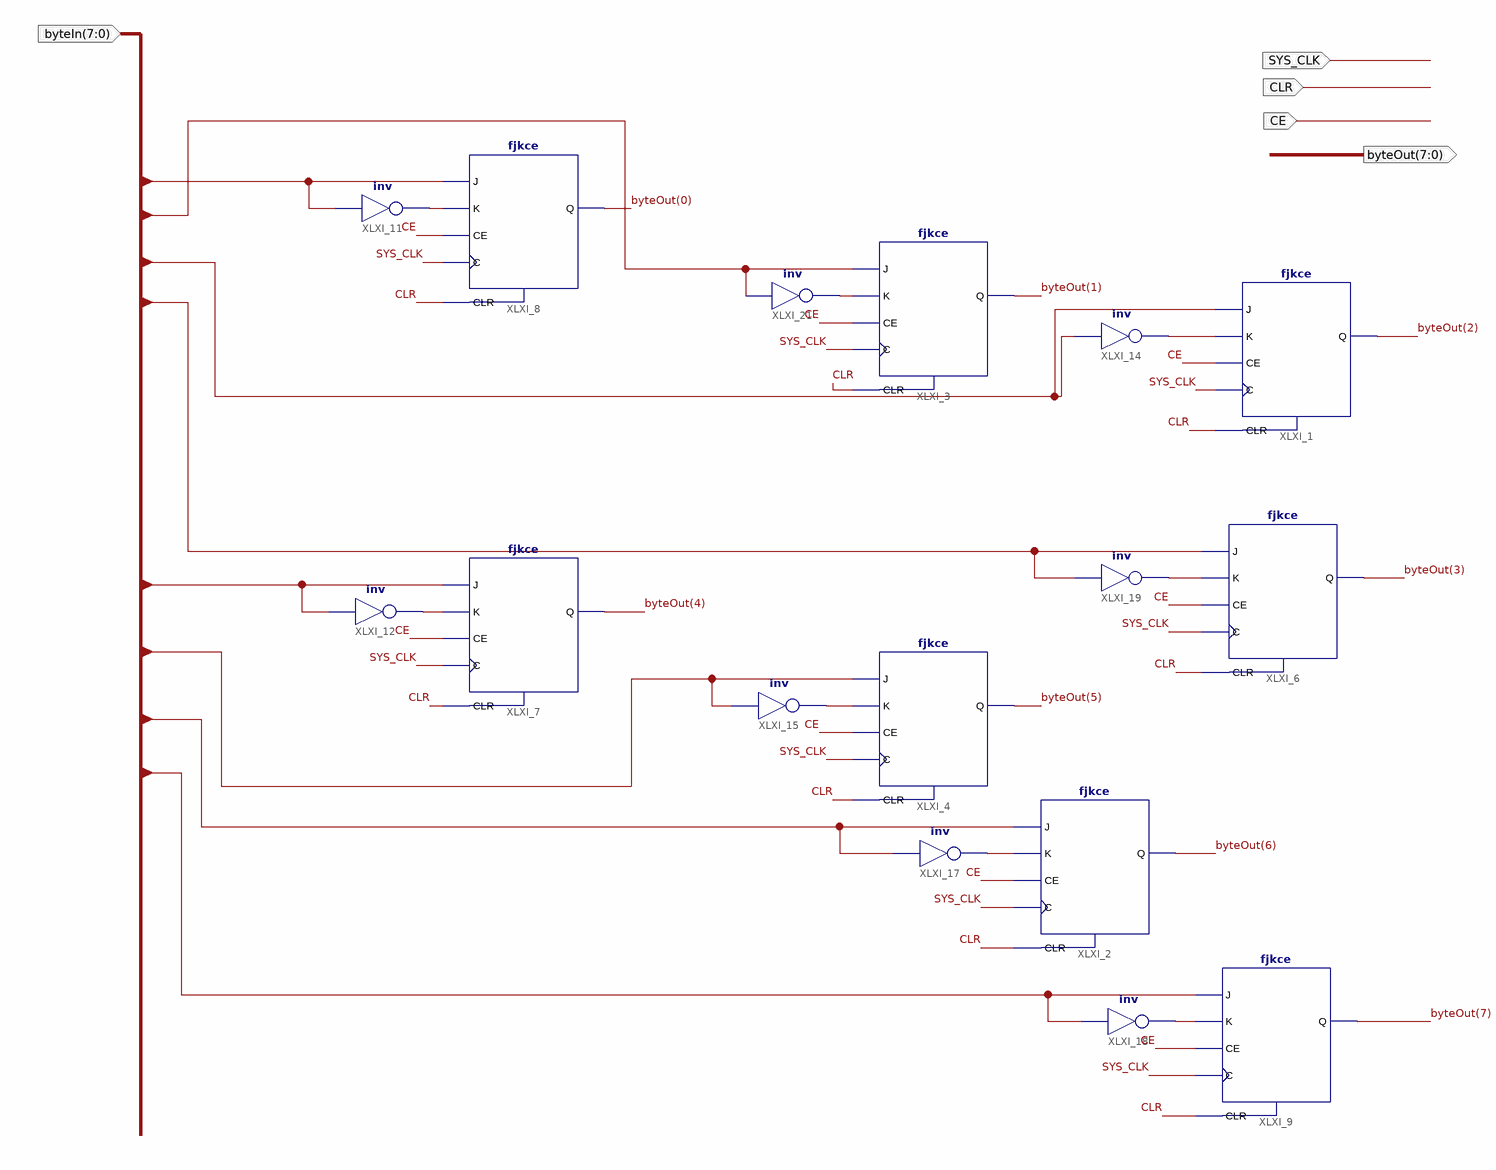
[diagram p0: schematic sheet 1]
// Xilinx ISE schematic memByte.sch (spartan3e) as structural Verilog: 16 symbols, 5 ports
module memByte (
  input  [7:0] byteIn,
  input  CE,
  input  SYS_CLK,
  input  CLR,
  output [7:0] byteOut
);

  wire XLXN_12, XLXN_15, XLXN_16, XLXN_17, XLXN_21, XLXN_25, XLXN_112, XLXN_114;

  fjkce XLXI_1 (.C(SYS_CLK), .CE(CE), .CLR(CLR), .J(byteIn[2]), .K(XLXN_114), .Q(byteOut[2]));
  fjkce XLXI_2 (.C(SYS_CLK), .CE(CE), .CLR(CLR), .J(byteIn[6]), .K(XLXN_16), .Q(byteOut[6]));
  fjkce XLXI_3 (.C(SYS_CLK), .CE(CE), .CLR(CLR), .J(byteIn[1]), .K(XLXN_112), .Q(byteOut[1]));
  fjkce XLXI_4 (.C(SYS_CLK), .CE(CE), .CLR(CLR), .J(byteIn[5]), .K(XLXN_12), .Q(byteOut[5]));
  fjkce XLXI_6 (.C(SYS_CLK), .CE(CE), .CLR(CLR), .J(byteIn[3]), .K(XLXN_25), .Q(byteOut[3]));
  fjkce XLXI_7 (.C(SYS_CLK), .CE(CE), .CLR(CLR), .J(byteIn[4]), .K(XLXN_15), .Q(byteOut[4]));
  fjkce XLXI_8 (.C(SYS_CLK), .CE(CE), .CLR(CLR), .J(byteIn[0]), .K(XLXN_21), .Q(byteOut[0]));
  fjkce XLXI_9 (.C(SYS_CLK), .CE(CE), .CLR(CLR), .J(byteIn[7]), .K(XLXN_17), .Q(byteOut[7]));
  not XLXI_11 (XLXN_21, byteIn[0]);
  not XLXI_12 (XLXN_15, byteIn[4]);
  not XLXI_15 (XLXN_12, byteIn[5]);
  not XLXI_17 (XLXN_16, byteIn[6]);
  not XLXI_18 (XLXN_17, byteIn[7]);
  not XLXI_19 (XLXN_25, byteIn[3]);
  not XLXI_14 (XLXN_114, byteIn[2]);
  not XLXI_21 (XLXN_112, byteIn[1]);
endmodule
